# Altium schematic sheet Sheet2.SchDoc
size A2
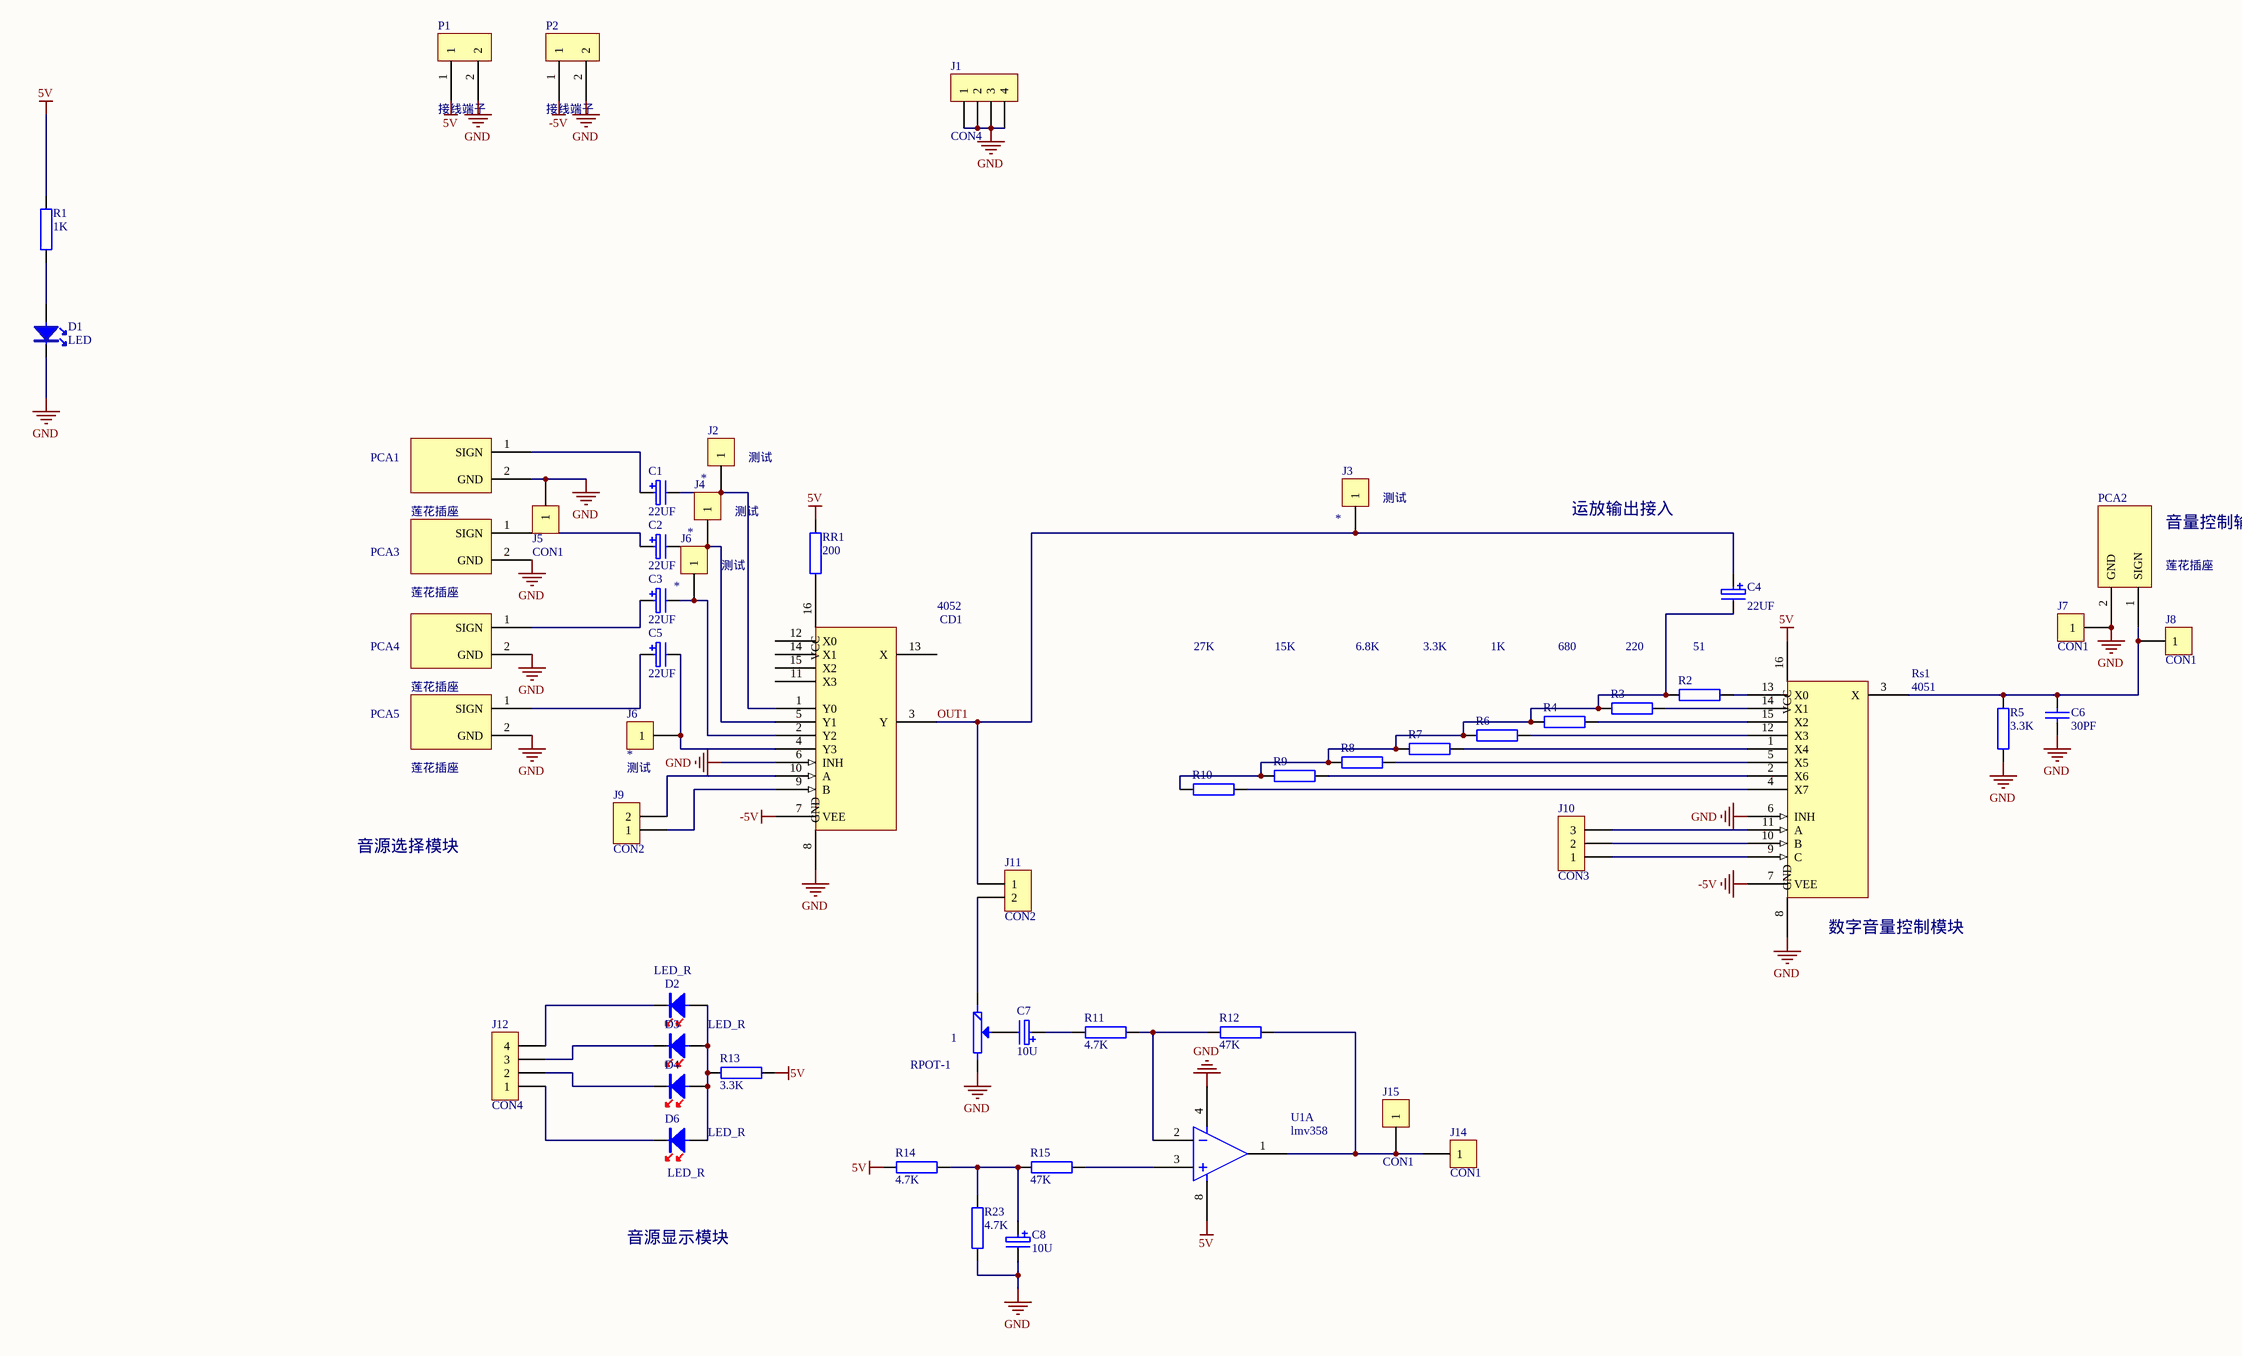
[diagram p0: Sheet2.SchDoc]

## Parts
(Parts that share a designator on the sheet are numbered #1, #2 ... from top to bottom, then left to right.)
1  RPOT-1  [RVR-2]
C1  22UF  [CAO2]
C2  22UF  [CAO2]
C3  22UF  [CAO2]
C4  22UF  [CAO2]
C5  22UF  [CAO2]
C6  30PF  [CAP2]
C7  10U  [CAO1]
C8  10U  [CAO1]
CD1  4052  [SO-16]
D1  LED  [LED2_B]
D2  LED_R  [LED2_B]
D3  LED_R  [LED2_B]
D4  LED_R  [LED2_B]
D6  LED_R  [LED2_B]
J1  CON4  [sip-4]
J2  *  [SIP-1]
J3  *  [SIP-1]
J4  *  [SIP-1]
J5  CON1  [SIP-1]
J6#1  *  [SIP-1]
J6#2  *  [SIP-1]
J7  CON1  [SIP-1]
J8  CON1  [SIP-1]
J9  CON2  [sip-2]
J10  CON3  [sip-3]
J11  CON2  [sip-2]
J12  CON4  [sip-4]
J14  CON1  [SIP-1]
J15  CON1  [SIP-1]
P1  接线端子  [接线端子]
P2  接线端子  [接线端子]
PCA1  莲花插座  [莲花母座]
PCA2  莲花插座  [莲花母座]
PCA3  莲花插座  [莲花母座]
PCA4  莲花插座  [莲花母座]
PCA5  莲花插座  [莲花母座]
R1  1K  [AXIAL0.4]
R2  51  [AXIAL0.4]
R3  220  [AXIAL0.4]
R4  680  [AXIAL0.4]
R5  3.3K  [AXIAL0.4]
R6  1K  [AXIAL0.4]
R7  3.3K  [AXIAL0.4]
R8  6.8K  [AXIAL0.4]
R9  15K  [AXIAL0.4]
R10  27K  [AXIAL0.4]
R11  4.7K  [AXIAL0.4]
R12  47K  [AXIAL0.4]
R13  3.3K  [AXIAL0.4]
R14  4.7K  [AXIAL0.4]
R15  47K  [AXIAL0.4]
R23  4.7K  [AXIAL0.4]
RR1  200  [AXIAL0.4]
Rs1  4051  [SO-16]
U1  lmv358  [SOP8]  (part A of 2)

## Nets
5V: P1.1 R1.2 R13.1 R14.1 RR1.1 Rs1.16(VCC) U1.8
-5V: CD1.7(VEE) P2.1 Rs1.7(VEE)
GND: 1.3 C6.2 C8.2 CD1.6(INH) CD1.8(GND) D1.2 J1.1 J1.2 J1.3 J1.4 J5.1 J7.1 P1.2 P2.2 PCA1.2(GND) PCA2.2(GND) PCA3.2(GND) PCA4.2(GND) PCA5.2(GND) R5.1 R23.1 Rs1.6(INH) Rs1.8(GND) U1.4
OUT1: C4.1 CD1.3(Y) J3.1 J11.1
Net1_1: 1.1 J11.2
Net1_2: 1.2(M) C7.2
NetC1_1: C1.1 PCA1.1(SIGN)
NetC1_2: C1.2 CD1.1(Y0) J2.1
NetC2_1: C2.1 PCA3.1(SIGN)
NetC2_2: C2.2 CD1.5(Y1) J4.1
NetC3_1: C3.1 PCA4.1(SIGN)
NetC3_2: C3.2 CD1.2(Y2) J6#1.1
NetC4_2: C4.2 R2.1 R3.1 R4.1 R6.1 R7.1 R8.1 R9.1 R10.1
NetC5_1: C5.1 PCA5.1(SIGN)
NetC5_2: C5.2 CD1.4(Y3) J6#2.1
NetC6_1: C6.1 J8.1 PCA2.1(SIGN) R5.2 Rs1.3(X)
NetC7_1: C7.1 R11.1
NetC8_1: C8.1 R14.2 R15.1 R23.2
NetCD1_9: CD1.9(B) J9.1
NetCD1_10: CD1.10(A) J9.2
NetCD1_16: CD1.16(VCC) RR1.2
NetD1_1: D1.1 R1.1
NetD2_1: D2.1 D3.1 D4.1 D6.1 R13.2
NetD2_2: D2.2 J12.4
NetD3_2: D3.2 J12.3
NetD4_2: D4.2 J12.2
NetD6_2: D6.2 J12.1
NetJ10_1: J10.1 Rs1.9(C)
NetJ10_2: J10.2 Rs1.10(B)
NetJ10_3: J10.3 Rs1.11(A)
NetJ14_1: J14.1 J15.1 R12.2 U1.1
NetR2_2: R2.2 Rs1.13(X0)
NetR3_2: R3.2 Rs1.14(X1)
NetR4_2: R4.2 Rs1.15(X2)
NetR6_2: R6.2 Rs1.12(X3)
NetR7_2: R7.2 Rs1.1(X4)
NetR8_2: R8.2 Rs1.5(X5)
NetR9_2: R9.2 Rs1.2(X6)
NetR10_2: R10.2 Rs1.4(X7)
NetR11_2: R11.2 R12.1 U1.2
NetR15_2: R15.2 U1.3

Not connected (* = marked no-connect by the designer): CD1 11(X3) 12(X0) 13(X) 14(X1) 15(X2)

## Notes on the sheet
- 运放输出接入
- 音量控制输出
- 音源选择模块
- (near Rs1) 数字音量控制模块
- 音源显示模块

## Library data of the parts
1 = RPOT-1: 普通电位器
C1-C5 C7 C8 = CAP3
C6 = CAP1
J1 J12 = CON4: Connector
J2-J5 J6#1 J6#2 J7 J8 J14 J15 = CON1: Connector
  J2-J4 J6#1 J6#2: 测试: 测试
J9 J11 = CON2: Connector
J10 = CON3: Connector
PCA1-PCA5 = PCA
R1-R15 R23 RR1 = RES: 电阻
U1 = NE5532: OPA2134: The OPA134 series are ultra-low distortion, low noise  operational amplifiers fully specified for audio appli-  cations. A true FET input stage was incorporated to  provide superior sound quality and speed for excep-  tional audio performance.